# EAGLE design MaxBuckSch (EAGLE 9.3.0)
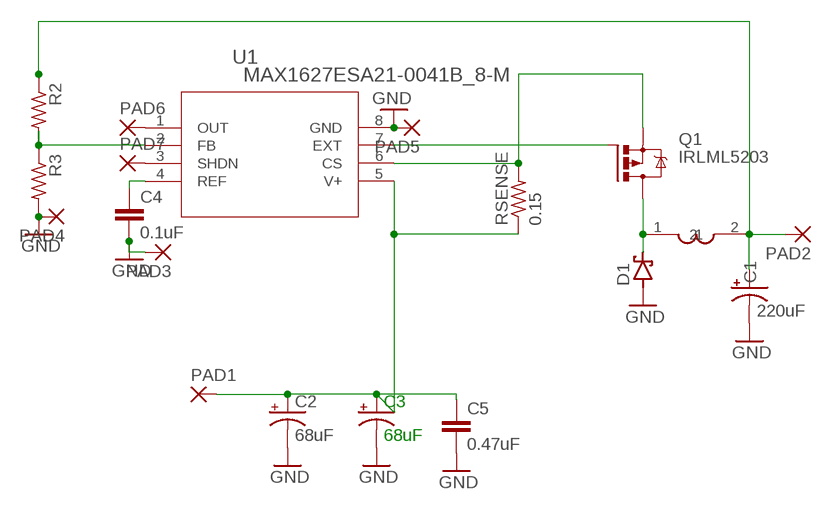
[diagram p0: schematic, sheet 1]

## Parts
C1  220uF  CPOL-USD/7343-31W  [D/7343-31W]
C2  68uF  CPOL-USD/7343-31W  [D/7343-31W]
C3  68uF  CPOL-USD/7343-31W  [D/7343-31W]
C4  0.1uF  C-EUC0805K  [C0805K]
C5  0.47uF  C-EUC0805K  [C0805K]
D1  SCHOTTKY-DIODESMC  [SMC]
PAD1  2,15/1,0  [2,15/1,0]
PAD2  2,15/1,0  [2,15/1,0]
PAD3  2,15/1,0  [2,15/1,0]
PAD4  2,15/1,0  [2,15/1,0]
PAD5  2,15/1,0  [2,15/1,0]
PAD6  2,15/1,0  [2,15/1,0]
PAD7  2,15/1,0  [2,15/1,0]
Q1  IRLML5203  [MICRO3]
R2  R-US_R0805W  [R0805W]
R3  R-US_R0805W  [R0805W]
RSENSE  0.15  R-US_R0805W  [R0805W]
U1  MAX1627ESA21-0041B_8-M  [21-0041B_8-M]
U$1  EE348  [INDUCTOR]

## Nets
GND [12mil]: C1.- C2.- C3.- C4.2 C5.2 D1.A PAD3.1(P) PAD4.1(P) PAD5.1(P) R3.2 U1.8(GND)
N$1 [12mil]: R2.2 R3.1 U1.2(FB)
N$2 [Power]: C2.+ C3.+ C5.1 PAD1.1(P) RSENSE.1 U1.5(V+)
N$3 [12mil]: Q1.2(S) RSENSE.2 U1.6(CS)
N$4 [12mil]: Q1.1(G) U1.7(EXT)
N$5 [Power]: C1.+ PAD2.1(P) R2.1 U$1.2
N$6 [12mil]: D1.C Q1.3(D) U$1.1
N$7: C4.1 U1.4(REF)
N$8: PAD6.1(P) U1.1(OUT)
N$9: PAD7.1(P) U1.3(SHDN)

## Library data of the parts
C1-C3 = rcl:CPOL-US: POLARIZED CAPACITOR, American symbol; SPICEPREFIX: C
C4 C5 = rcl:C-EU: CAPACITOR, European symbol; SPICEPREFIX: C
D1 = diode:SCHOTTKY-DIODE: Schottky Diode
PAD1-PAD7 = wirepad:2,15/1,0: THROUGH-HOLE PAD
Q1 = transistor-power:IRLML5203: HEXFET P-Channel Power MOSFET
R2 R3 RSENSE = rcl:R-US_: RESISTOR, American symbol; SPICEPREFIX: R
U1 = MAX1627:MAX1627ESA; MANUFACTURER_PART_NUMBER: max1627esa; VENDOR: Maxim Integrated Products
U$1 = EE348:EE348

## Net classes
0 7mil: width 0.178 mm, drill 0.254 mm, clearance 0.127 mm
1 12mil: width 0.305 mm, drill 0.254 mm, clearance 0.127 mm
2 Power: width 1.219 mm, drill 0.254 mm, clearance 0.127 mm

## Board
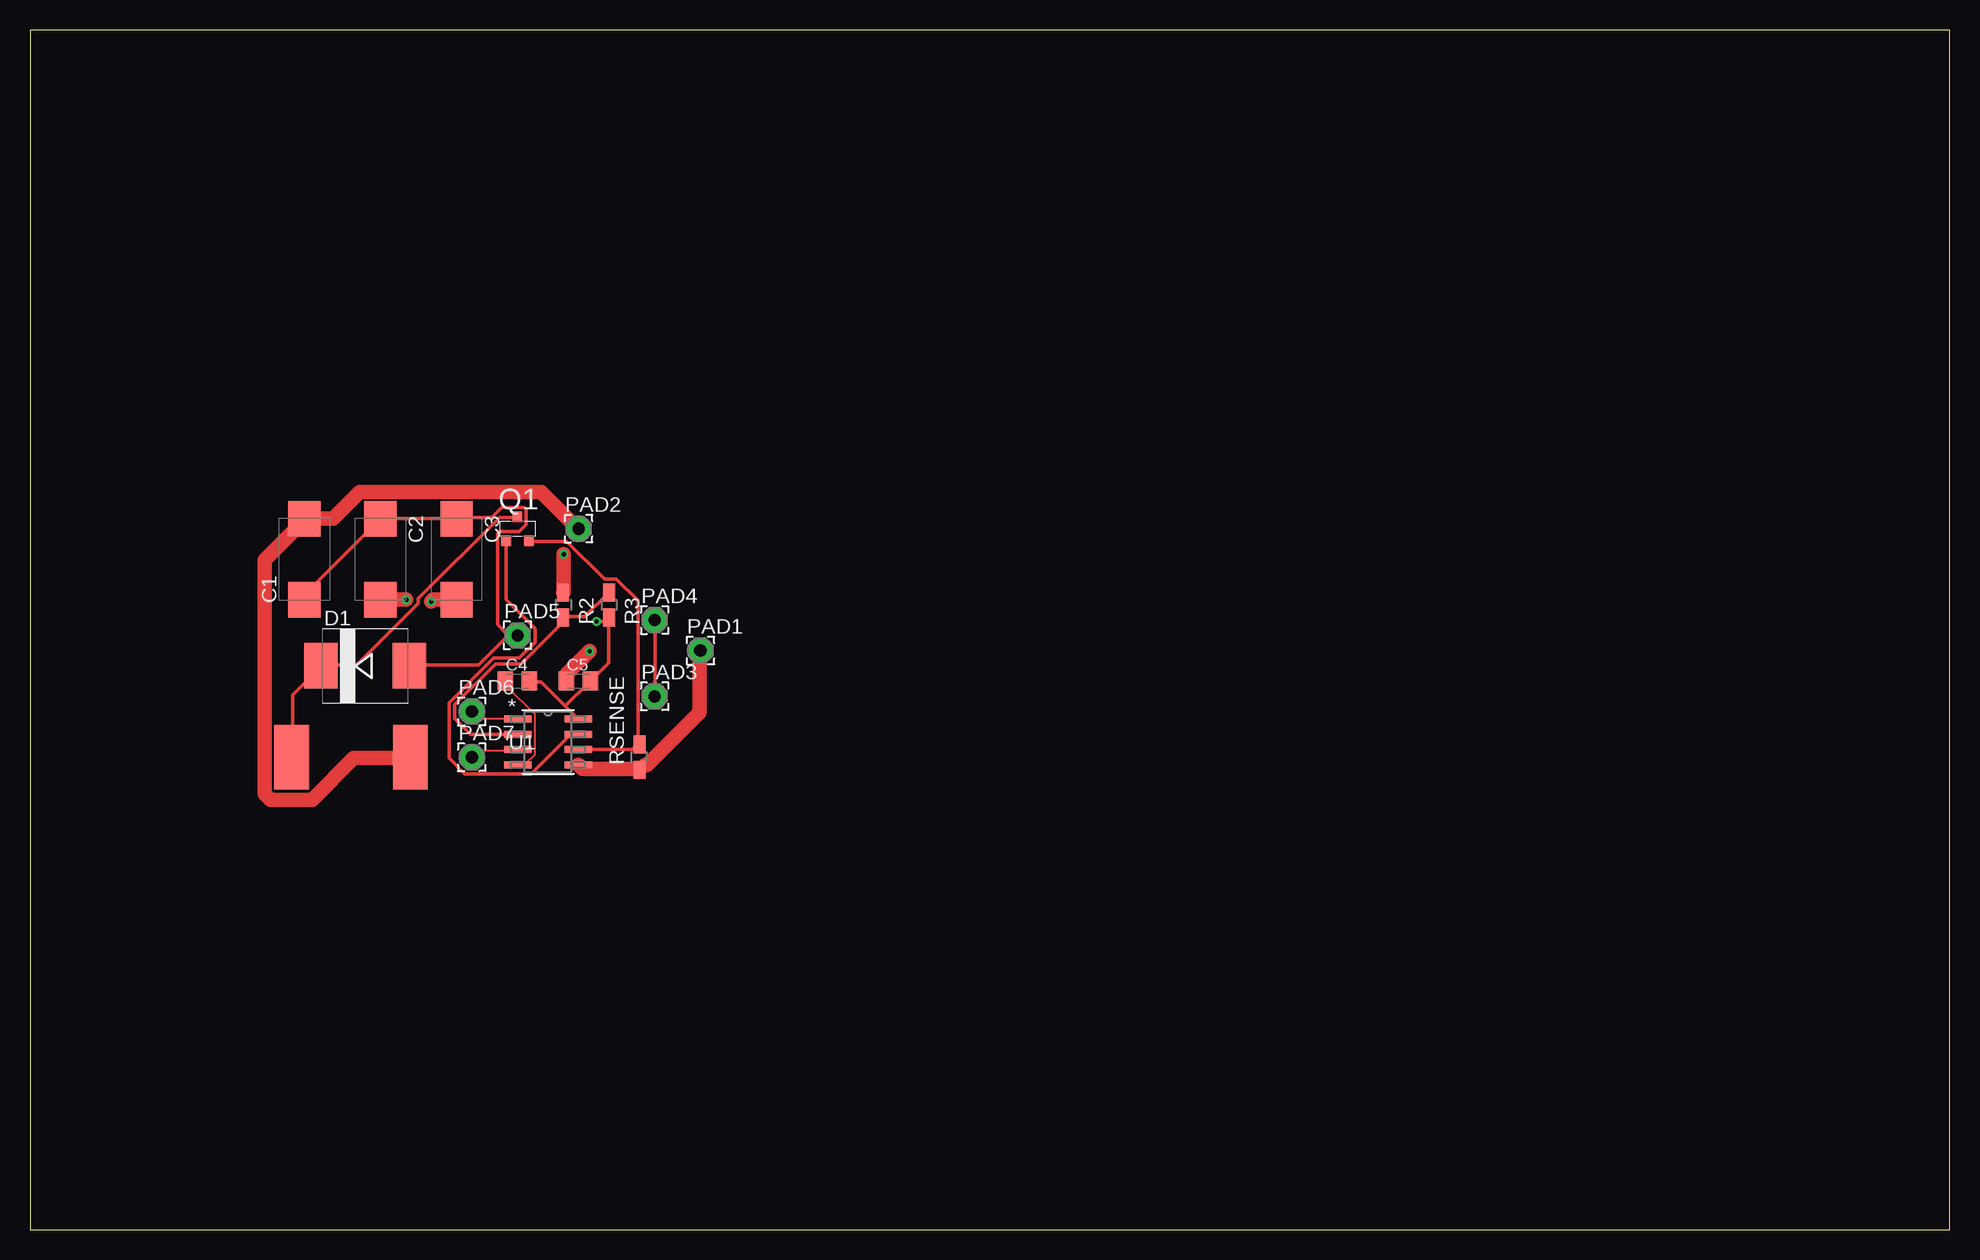
[diagram p1: board, top side]
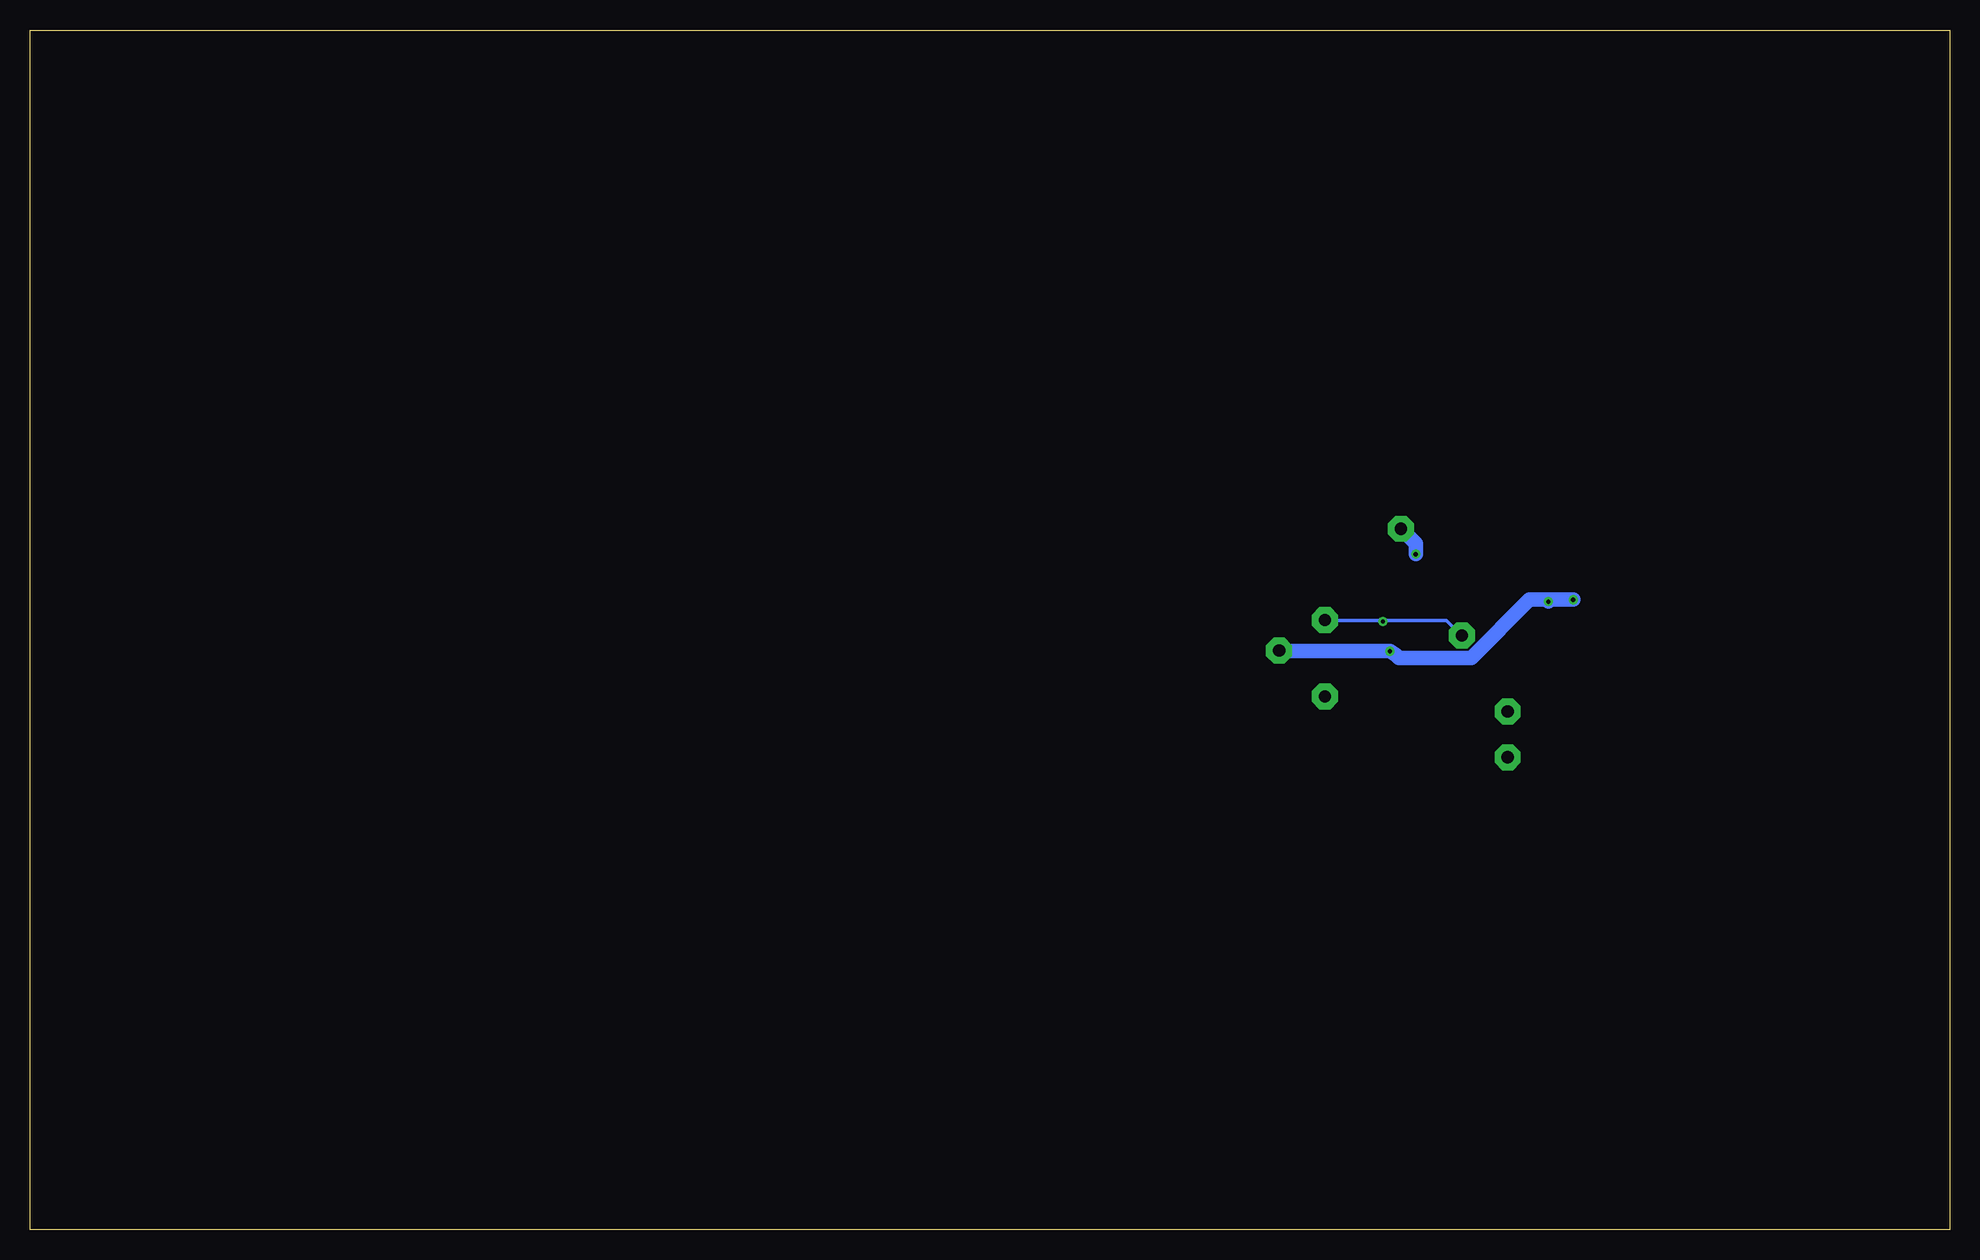
[diagram p2: board, bottom side, seen from below]

Size 160 x 100 mm. Coordinates in mm from the lower left corner, seen from the top.
Outline: 0,0 160,0 160,100 0,100 0,0
Copper layers (1*16): Top 0.035mm / dielectric 1.5mm / Bottom 0.035mm
Design rules "default": minimum track width 6mil, minimum drill 0.35mm, track to track 6mil, track to pad 6mil, pad to pad 6mil, via to via 6mil, smd to smd 6mil, copper to edge 40mil, drill to drill 6mil, minimum pad ring 10mil, minimum via ring 8mil, stop-mask expansion 4mil, vias tented up to drill 0mil, thermal gap 10mil

### Footprints (pad centres in the part's own frame; a part is rotated, then mirrored left to right if it is on the bottom)
D/7343-31W = smd 2.95 x 2.7: + 3.375,0; - -3.375,0
C0805K = smd 1.3 x 1.6: 1 -1,0; 2 1,0
SMC = smd 2.8 x 3.8: A 3.7,0; C -3.7,0
2,15/1,0 = drill 1.016 pad 2.159 octagon: 1 0,0
MICRO3 = smd 0.8 x 0.9: 1 -0.95,-1; 2 0.95,-1; 3 0,1
R0805W = smd 1.5 x 1: 1 -1.052,0; 2 1.052,0
21-0041B_8-M = smd 2.286 x 0.584: 1 -2.515,1.905; 2 -2.515,0.635; 3 -2.515,-0.635; 4 -2.515,-1.905; 5 2.515,-1.905; 6 2.515,-0.635; 7 2.515,0.635; 8 2.515,1.905
INDUCTOR = smd 5.4 x 2.9: 1 0,4.87; 2 0,-5.03

### Placement (x,y rotation side)
C1  22.86,55.88 90 top
C2  29.21,55.88 270 top
C3  35.56,55.88 270 top
C4  40.64,45.72 0 top
C5  45.72,45.72 0 top
D1  27.94,46.99 0 top
PAD1  55.88,48.26 0 top
PAD2  45.72,58.42 0 top
PAD3  52.07,44.45 0 top
PAD4  52.07,50.8 0 top
PAD5  40.64,49.53 0 top
PAD6  36.83,43.18 0 top
PAD7  36.83,39.37 0 top
Q1  40.64,58.42 0 top
R2  44.45,52.07 270 top
R3  48.26,52.07 270 top
RSENSE  50.8,39.37 90 top
U1  43.18,40.64 0 top
U$1  26.67,39.37 90 top

### Tracks (layer width: path | path; a pad name or v marks a point on that pad's centre or on a via)
GND  (via drill 0.35)
  Top 0.305: C1.- 22.87,52.58 22.87,52.91 29.14,59.19 C2.- 29.3,59.27 35.5,59.27 C3.- 35.66,59.35 38.47,59.35 39.29,60.18 41.19,60.18 41.36,60.01 41.36,58.78 40.78,58.2 39.13,58.2 38.96,58.03 38.96,50.44 39.79,49.61 PAD5.1 39.87,49.53 37.4,47.05 31.7,47.05 D1.A | 44.62,43.63 45.65,42.6 U1.8 | 44.62,43.63 42.6,45.65 41.69,45.65 C4.2 | 44.62,43.63 46.64,45.65 C5.2 46.72,45.73 48.21,47.22 48.21,51.02 R3.2 48.13,50.69 v47.22,50.69 | PAD3.1 52.09,44.49 52.09,50.77 PAD4.1
  Bottom 0.305: 47.22,50.77 41.94,50.77 40.7,49.53 PAD5.1 | 47.22,50.77 52.01,50.77 PAD4.1 | v47.22,50.69 47.22,50.77
N$1
  Top 0.305: R3.1 48.21,53.08 46.23,51.1 44.49,51.1 R2.2 44.33,50.93 44.33,50.52 40.95,47.14 38.8,47.14 35.41,43.75 35.41,42.6 36.73,41.27 U1.2
N$2  (via drill 0.35)
  Top 1.219: U1.5 45.73,38.72 46.06,38.39 50.77,38.39 RSENSE.1 51.26,38.72 51.43,38.72 55.8,43.09 55.8,48.21 PAD1.1 | v46.64,48.21 44.74,46.31 44.74,45.73 C5.1 | v31.37,52.5 29.22,52.5 C2.+ | v33.43,52.34 33.6,52.5 35.5,52.5 C3.+
  Bottom 1.219: PAD1.1 55.8,48.21 v46.64,48.21 46.15,47.88 45.9,47.63 39.87,47.63 35,52.5 33.43,52.5 | 33.43,52.5 v31.37,52.5 | v33.43,52.34 33.43,52.5
N$3
  Top 0.305: Q1.2 41.6,57.37 44.74,57.37 47.88,54.23 48.87,54.23 50.69,52.42 50.69,40.53 50.77,40.45 RSENSE.2 50.6,40.45 50.19,40.04 45.73,40.04 U1.6
N$4
  Top 0.305: U1.7 45.07,41.27 41.77,37.97 36.24,37.97 34.92,39.29 34.92,43.92 38.63,47.63 40.78,47.63 42.1,48.95 42.1,50.11 39.71,52.5 39.71,57.37 Q1.1
N$5  (via drill 0.35)
  Top 1.219: v44.49,56.3 44.49,53.16 R2.1 | PAD2.1 45.65,58.45 42.6,61.5 27.49,61.5 25.26,59.27 22.87,59.27 C1.+ 22.54,58.78 19.56,55.8 19.56,36.32 20.06,35.83 23.53,35.83 26.99,39.29 31.7,39.29 U$1.2
  Bottom 1.219: v44.49,56.3 44.49,57.21 45.65,58.36 PAD2.1
N$6
  Top 0.305: Q1.3 40.62,59.35 39.13,59.35 32.36,52.58 32.36,52.17 27.24,47.05 24.27,47.05 D1.C 24.19,46.89 21.88,44.58 21.88,39.38 U$1.1
N$7
  Top 0.178: C4.1 39.71,45.65 39.71,45.32 42.1,42.93 42.1,39.62 41.27,38.8 40.7,38.8 U1.4
N$8
  Top 0.178: U1.1 40.62,42.6 37.48,42.6 36.9,43.17 PAD6.1
N$9
  Top 0.178: U1.3 40.62,39.95 37.48,39.95 36.9,39.38 PAD7.1